# EAGLE design CANBedV1.1 (EAGLE 6.4)
DESCRIPTION: microOBD 200 OBD-II Module; HW_REV: 1.4; PCB_REV: C; PCB_SPEC1: Layer Count: 4; PCB_SPEC2: Size: 1.3" x 0.59"; PCB_SPEC3: Finish Thickness: 0.049" - 0.052"; PCB_SPEC4: Copper Weight: 1oz; TITLE: STM1120

## Sheet 1 of 2
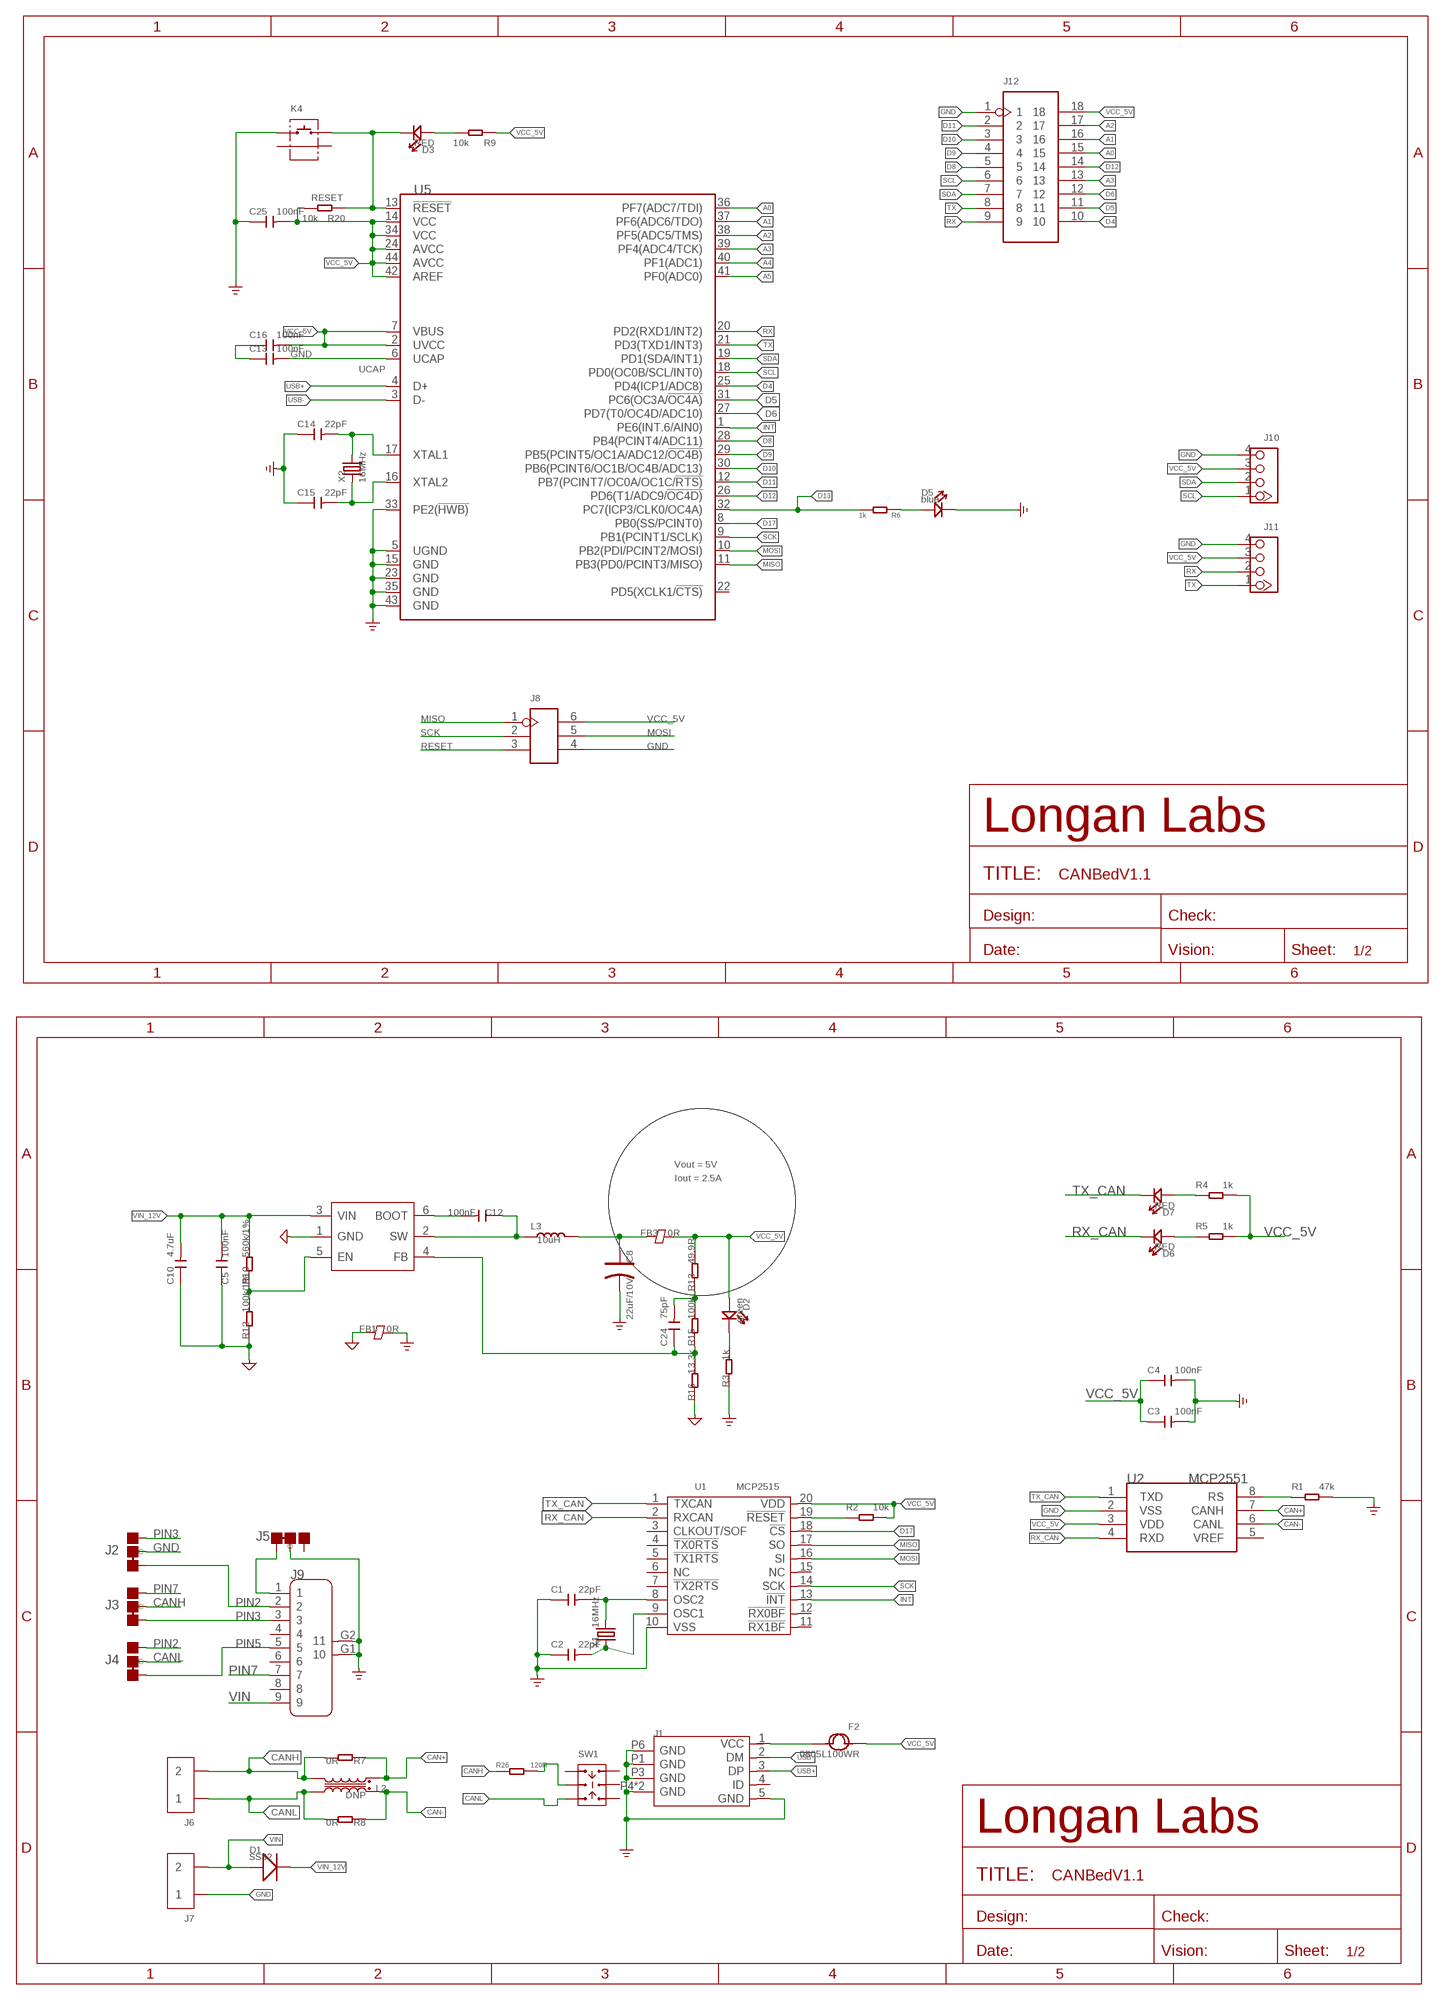
[diagram p0: schematic, sheet 1]

### Parts
C1  22pF  CAP-0603  [C0603]
C2  22pF  CAP-0603  [C0603]
C3  100nF  CAP-0603  [C0603]
C4  100nF  CAP-0603  [C0603]
C5  100nF  CAP-0603  [C0603]
C8  22uF/10V  CAP-POLAR-AVX-B  [AVX-B]
C10  4.7uF  CAP-1206  [C1206]
C12  100nF  CAP-0603  [C0603]
C13  100nF  CAP-0603  [C0603]
C14  22pF  CAP-0603  [C0603]
C15  22pF  CAP-0603  [C0603]
C16  100nF  CAP-0603  [C0603]
C24  75pF  CAP-0603  [C0603]
C25  100nF  CAP-0603  [C0603]
D1  SS32  DIODE'SMA'  [DO-214AC]
D2  green  LED'0603'  [LED-0603]
D3  RED  LED'0603'  [LED-0603]
D5  blue  LED'0603'  [LED-0603]
D6  RED  LED'0603'  [LED-0603]
D7  RED  LED'0603'  [LED-0603]
F2  0805L100WR  FUSE0805  [F0805]
FB1  0R  FERRITE-BEAD-0805  [F0805]
FB3  0R  FERRITE-BEAD-0805  [F0805]
J1  MICRO-USB5+4P-320010050  [MICRO-USB5+5P-SMD-0.65-7.2X5.06MM]
J2  JUMPER-3P-SHORT  [3P-SMD-SHORT]
J3  JUMPER-3P-SHORT  [3P-SMD-SHORT]
J4  JUMPER-3P-SHORT  [3P-SMD-SHORT]
J5  JUMPER-3P-SHORT  [3P-SMD-SHORT]
J6  SCREW-TERMINAL-2P'5.08'  [H2-5.0-10.5X8.0MM]
J7  SCREW-TERMINAL-2P'5.08'  [H2-5.0-10.5X8.0MM]
J8  HEADER-2X3P-2.54  [H2X3-2.54]
J9  DB9'MEAL'  [DB9-MEAL]
J10  320110033  GROVE-CONNECTOR-DIP-2.0  [HW4-2.0]
J11  320110033  GROVE-CONNECTOR-DIP-2.0  [HW4-2.0]
J12  HEADER-2X9P-2.54  [H2X9-2.54]
K4  BUTTON-2+2P  [SW2+2P-7.7X2.75X3.95MM]
L2  DNP  INDUCTOR-COMMON-MODE-SRF2012-900YA  [INT4-0.85-2X1.25X1.2MM]
L3  10uH  INDUCTOR-6.6X7.1  [INT2-SMD-6.6X7.1X3MM]
R1  47k  RES-0603  [R0603]
R2  10k  RES-0603  [R0603]
R3  1k  RES-0603  [R0603]
R4  1k  RES-0603  [R0603]
R5  1k  RES-0603  [R0603]
R6  1k  RES-0603  [R0603]
R7  0R  RES-0603  [R0603]
R8  0R  RES-0603  [R0603]
R9  10k  RES-0603  [R0603]
R10  560k/1%  RES-0603  [R0603]
R12  100k/1%  RES-0603  [R0603]
R13  49.9R  RES-0603  [R0603]
R15  100k  RES-0603  [R0603]
R16  13.3k  RES-0603  [R0603]
R20  10k  RES-0603  [R0603]
R26  120R  RES-0603  [R0603]
SW1  SWITCH-2CH-6P-311010004  [SW6-2.54-9.0X3.5X3.2+2.0MM]
U1  MCP2515  MCP2515'ST'  [TSSOP20-0.65-6.5X4.4MM]
U2  MCP2551  MCP2551-SOIC8  [SOIC8-6.0]
U5  MCU-ATMEGA32U4-AU  [TQFP44-0.8-9.6X9.6MM]
U6  PMIC-TPS54302  [SOT-23-6]
X1  16MHz  CRYSTAL-2P'HC49US'  [HC49US]
X2  16MHz  CRYSTAL-2P'HC49US'  [HC49US]

### Nets
A0: J12.15 U5.36(PF7(ADC7/TDI))
A1: J12.16 U5.37(PF6(ADC6/TDO))
A2: J12.17 U5.38(PF5(ADC5/TMS))
A3: J12.13 U5.39(PF4(ADC4/TCK))
A4: U5.40(PF1(ADC1))
A5: U5.41(PF0(ADC0))
AGND: C5.1 C10.1 FB1.1 R12.1 R16.1 U6.1(GND) ; supply symbol labelled GND_SIGNAL
CAN+: L2.4 R7.1 U2.7(CANH)
CAN-: L2.1 R8.1 U2.6(CANL)
CANH: J3.MM(C) J6.2 L2.3 R7.2 R26.1
CANL: J4.MM(C) J6.1 L2.2 R8.2 SW1.CH1B
D4: J12.10 U5.25(PD4(ICP1/ADC8))
D5: J12.11 U5.31(PC6(OC3A/!OC4A))
D6: J12.12 U5.27(PD7(T0/OC4D/ADC10))
D8: J12.5 U5.28(PB4(PCINT4/ADC11))
D9: J12.4 U5.29(PB5(PCINT5/OC1A/ADC12/!OC4B))
D10: J12.3 U5.30(PB6(PCINT6/OC1B/OC4B/ADC13))
D11: J12.2 U5.12(PB7(PCINT7/OC0A/OC1C/!RTS))
D12: J12.14 U5.26(PD6(T1/ADC9/!OC4D))
D13: R6.2 U5.32(PC7(ICP3/CLK0/OC4A))
D17: U1.18(!CS) U5.8(PB0(SS/PCINT0))
EXT_PWR: F2.2 J1.1(VCC)
GND: C1.1 C2.1 C3.2 C4.2 C8.- C13.1 C14.1 C15.1 C16.1 C25.1 D5.- FB1.2 J1.5(GND) J1.P1(GND) J1.P3(GND) J1.P4(GND) J1.P5(GND) J1.P6(GND) J2.MM(C) J5.MM(C) J7.1 J8.4 J9.G1 J9.G2 J10.4 J11.4 J12.1 K4.1 R1.2 R3.1 U1.10(VSS) U2.2(VSS) U5.5(UGND) U5.15(GND) U5.23(GND) U5.33(PE2(!HWB)) U5.35(GND) U5.43(GND) ; supply symbol labelled GND_POWER
INT: U1.13(!INT) U5.1(PE6(INT.6/AIN0))
MISO: J8.1 U1.17(SO) U5.11(PB3(PD0/PCINT3/MISO))
MOSI: J8.5 U1.16(SI) U5.10(PB2(PDI/PCINT2/MOSI))
N$1: D2.- R3.2
N$2: D7.+ R4.1
N$3: D3.+ R9.2
N$4: R10.1 R12.2 U6.5(EN)
N$5: R26.2 SW1.COM1
N$6: C14.2 U5.17(XTAL1) X2.2
N$8: D5.+ R6.1
N$11: C12.1 L3.1 U6.2(SW)
N$12: C15.2 U5.16(XTAL2) X2.1
N$13: J5.11(L) J9.1
N$14: C12.2 U6.6(BOOT)
N$15: D6.+ R5.1
N$16: C1.2 U1.8(OSC2) X1.2
N$17: C2.2 U1.9(OSC1) X1.1
N$19: C8.+ FB3.1 L3.2
N$20: R1.1 U2.8(RS)
N$23: C24.2 R13.1 R15.2
N$26: C24.1 R15.1 R16.2 U6.4(FB)
PIN2: J2.11(L) J4.00(R) J9.2
PIN3: J2.00(R) J3.11(L) J9.3
PIN5: J4.11(L) J9.5
PIN7: J3.00(R) J9.7
RESET: D3.- J8.3 K4.2 R20.1 U5.13(!RESET)
RST_N: R2.1 U1.19(!RESET)
RX: J11.2 J12.9 U5.20(PD2(RXD1/INT2))
RX_CAN: D6.- U1.2(RXCAN) U2.4(RXD)
SCK: J8.2 U1.14(SCK) U5.9(PB1(PCINT1/SCLK))
SCL: J10.1 J12.6 U5.18(PD0(OC0B/SCL/INT0))
SDA: J10.2 J12.7 U5.19(PD1(SDA/INT1))
TX: J11.1 J12.8 U5.21(PD3(TXD1/INT3))
TX_CAN: D7.- U1.1(TXCAN) U2.1(TXD)
UCAP: C13.2 U5.6(UCAP)
USB+: J1.3(DP) U5.4(D+)
USB-: J1.2(DM) U5.3(D-)
VCC_5V: C3.1 C4.1 C16.2 C25.2 D2.+ F2.1 FB3.2 J8.6 J10.3 J11.3 J12.18 R2.2 R4.2 R5.2 R9.1 R13.2 R20.2 U1.20(VDD) U2.3(VDD) U5.2(UVCC) U5.7(VBUS) U5.14(VCC) U5.24(AVCC) U5.34(VCC) U5.42(AREF) U5.44(AVCC)
VIN: D1.1(+) J7.2 J9.9
VIN_12V: C5.2 C10.2 D1.2(-) R10.2 U6.3(VIN)
Unconnected: J1.4(ID) J5.00(R) J9.4 J9.6 J9.8 K4.S1 K4.S2 SW1.CH1A SW1.CH2A SW1.CH2B SW1.COM2 U1.3(CLKOUT/SOF) U1.4(!TX0RTS) U1.5(!TX1RTS) U1.6(NC) U1.7(!TX2RTS) U1.11(!RX1BF) U1.12(!RX0BF) U1.15(NC) U2.5(VREF) U5.22(PD5(XCLK1/!CTS))

### Notes on the sheet
- Vout = 5V
- Iout = 2.5A

## Sheet 2 of 2

## Library data of the parts
C1-C5 C10 C12-C16 C24 C25 = Discrete-new:CAP: Ceramic Capacitors
C8 = Discrete-new:CAP-POLAR: Electrolytic Capacitors,Tantalum Capacitors and Super Capacitors
D1 = Discrete-new:DIODE*
D2 D3 D5-D7 = Discrete-new:LED
F2 = Discrete-small:FUSE
FB1 FB3 = Discrete-new:FERRITE-BEAD
J1 = Connector-new:MICRO-USB5+4P: 320010137:MICRO USB B型DIP 沉板0.7无卷边 -ST-USB-01H2 320010000:MICRO USB 5F CCHT 6.45(0.8X0.9) -ST-USB-001G 320010050:USB-MC-001-05 320010025:MICRO USB 5S AB TYPE DIP7.2
J2-J5 = Discrete-new:JUMPER-3P-SHORT
J6 J7 = Connector-new:SCREW-TERMINAL-2P: 2P-3.5:320110028;2P-5.0:320110031
J8 = Connector-new:HEADER-2X3P
J9 = Connector:DB9
J10 J11 = Connector-new:GROVE-CONNECTOR-DIP: 4P-2.0:320110033;4P-2.0-90D:320110034
J12 = Connector-new:HEADER-2X9P
K4 = Connector-new:BUTTON-2+2P
L2 = Discrete-new:INDUCTOR-COMMON-MODE
L3 = Discrete-new:INDUCTOR
R1-R10 R12 R13 R15 R16 R20 R26 = Discrete-new:RES
SW1 = Switch:SWITCH-2CH-6P
U1 = Heilight:MCP2515
U2 = IC:MCP2551: High-Speed CAN Transceiver http://ww1.microchip.com/downloads/en/devicedoc/21667f.pdf
U5 = IC-new:MCU-ATMEGA32U4: TQFP-44:310010010;VQFN-44:310010016
U6 = IC-new:PMIC-TPS54302
X1 X2 = Discrete-new:CRYSTAL-2P

## Net classes
0 default: width 0.152 mm, clearance 0.152 mm
3 usbvcc: width 0.152 mm, drill 0.152 mm, clearance 0.152 mm

## Board
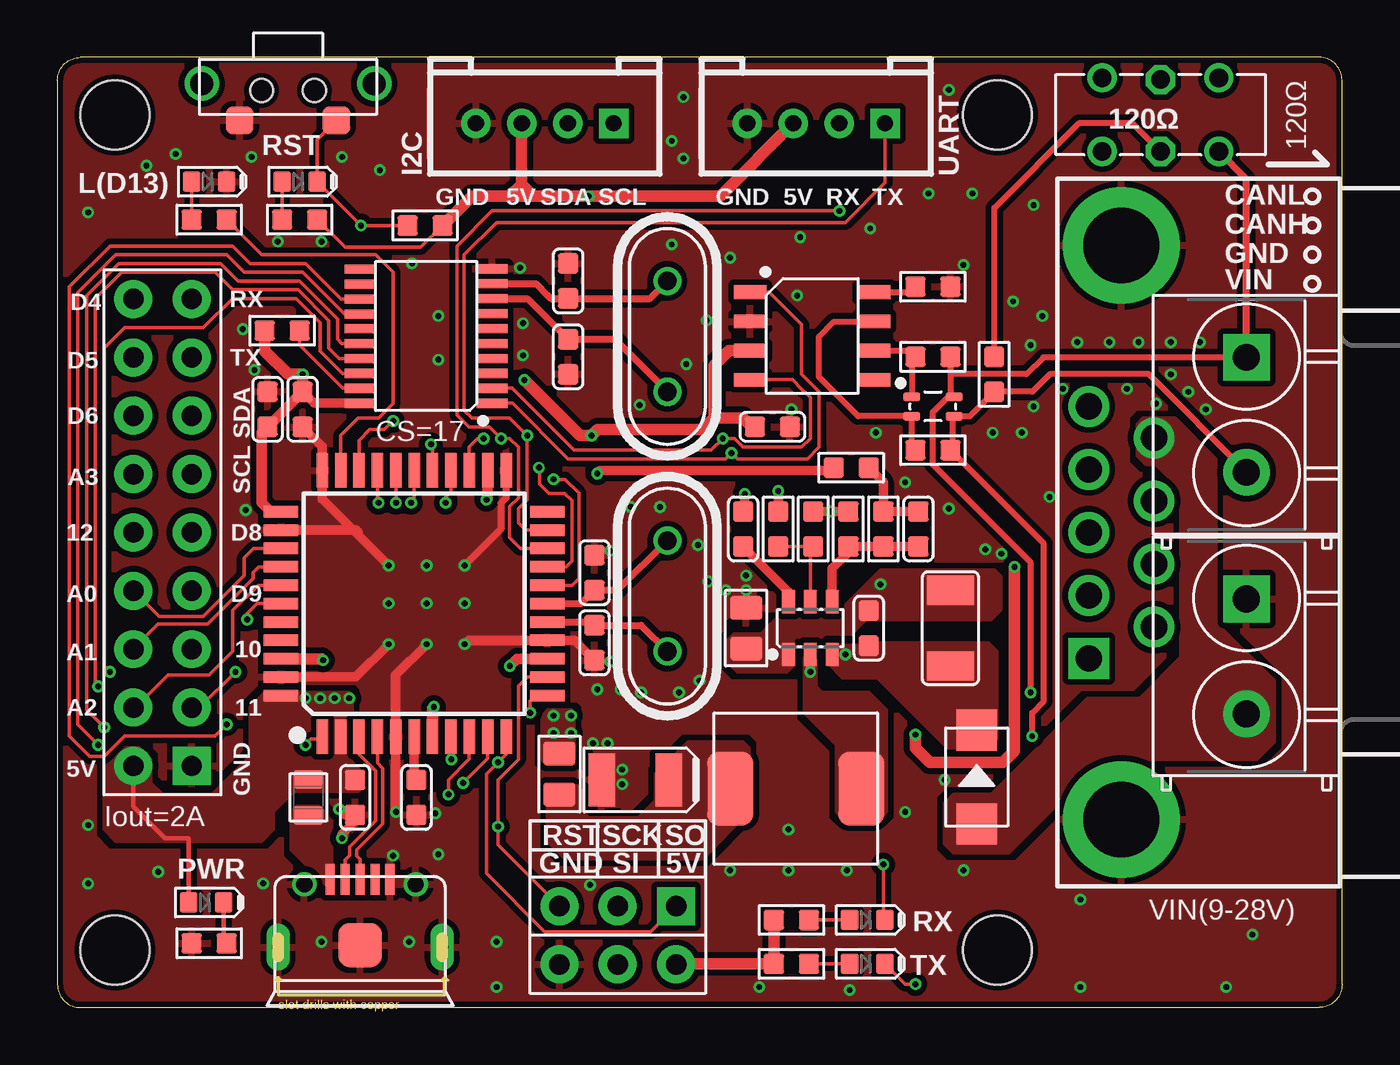
[diagram p1: board, top side]
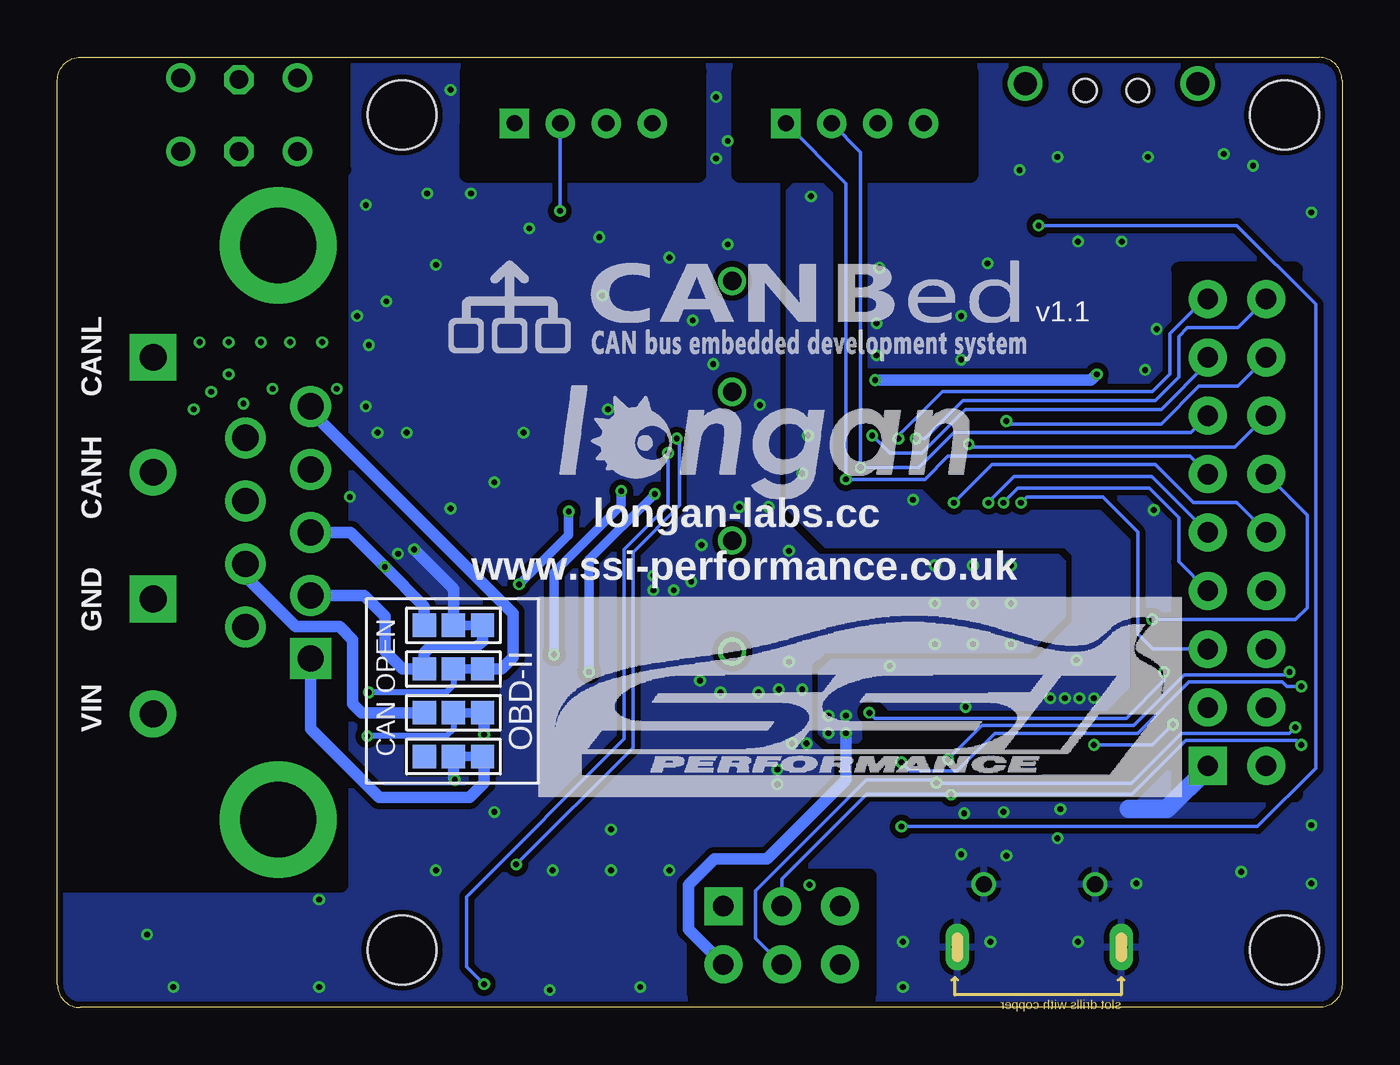
[diagram p2: board, bottom side, seen from below]

Size 55.91 x 41.35 mm. Coordinates in mm from the lower left corner, seen from the top.
Outline: 1,0 54.91,0 arc90 55.91,1 55.91,40.35 arc84 55.01,41.35 1,41.35 arc90 0,40.35 0,1 arc90 1,0
Copper layers (1*16): Top 0.035mm / dielectric 1.5mm / Bottom 0.035mm
Design rules "SeeedStudio_2layer_DRU_no_angle_20140221 *": minimum track width 1mil, minimum drill 10mil, track to track 6mil, track to pad 6mil, pad to pad 6mil, via to via 6mil, smd to smd 0mil, copper to edge 10mil, drill to drill 10mil, minimum pad ring 4mil, minimum via ring 4mil, stop-mask expansion 2mil, vias tented up to drill 25mil, thermal gap 10mil
Holes 3 mm at 2.5,38.85 2.5,2.5 40.91,38.85 40.91,2.5
bRestrict: area 16.2,36.3 to 26.2,40.7; area 28,36.2 to 38.1,40.7; area 2,9.3 to 7.1,32.1; area 43.6,5.3 to 55.8,36.1; area 20.6,0.6 to 28.2,5.7; area 43.4,36.5 to 52.6,41.3

### Footprints (pad centres in the part's own frame; a part is rotated, then mirrored left to right if it is on the bottom)
C0603 = smd 0.889 x 0.889: 1 -0.762,0; 2 0.762,0
AVX-B = smd 1.143 x 2.286: + 1.46,0; - -1.46,0
C1206 = smd 1.27 x 2.032: 1 -1.651,0; 2 1.651,0
DO-214AC = smd 1.8 x 1.77: 1 -2.042,0; 2 2.042,0
LED-0603 = smd 0.762 x 0.889: + 0.762,0; - -0.762,0
F0805 = smd 0.819 x 1.27: 1 -0.79,0; 2 0.79,0
F0805' = smd 1.016 x 1.397: 1 -0.889,0; 2 0.889,0
MICRO-USB5+5P-SMD-0.65-7.2X5.06MM = smd 0.4 x 1.35: 1 -1.3,2.875; 2 -0.65,2.875; 3 0,2.875; 4 0.65,2.875; 5 1.3,2.875 | smd 1.9 x 1.9: P1 0,0 | drill 0.508 pad 1.016 long: P3 -3.575,-0.08; P4 3.575,-0.08 | drill 0.7: P5 -2.425,2.65; P6 2.425,2.65
3P-SMD-SHORT = smd 1.016 x 1.016: 00 -1.27,0; 11 1.27,0; MM 0,0
H2-5.0-10.5X8.0MM = drill 1.168 pad 2.032 square: 1 0,2.5 | drill 1.168 pad 2.032: 2 0,-2.5
H2X3-2.54 = drill 0.889 pad 1.651 square: 1 -1.27,2.54 | drill 0.889 pad 1.651: 2 -1.27,0; 3 -1.27,-2.54; 4 1.27,-2.54; 5 1.27,0; 6 1.27,2.54
DB9-MEAL = drill 1.143 pad 1.778 square: 1 -5.486,1.422 | drill 1.143 pad 1.778: 2 -2.743,1.422; 3 0,1.422; 4 2.743,1.422; 5 5.486,1.422; 6 -4.115,-1.422; 7 -1.372,-1.422; 8 1.372,-1.422; 9 4.115,-1.422 | drill 3.302 pad 5.08: G1 12.497,0; G2 -12.497,0
HW4-2.0 = drill 0.7 pad 1.27 square: 1 -3,0 | drill 0.7 pad 1.27: 2 -1,0; 3 1,0; 4 3,0
H2X9-2.54 = drill 0.889 pad 1.651 square: 1 -1.27,10.16 | drill 0.889 pad 1.651: 2 -1.27,7.62; 3 -1.27,5.08; 4 -1.27,2.54; 5 -1.27,0; 6 -1.27,-2.54; 7 -1.27,-5.08; 8 -1.27,-7.62; 9 -1.27,-10.16; 10 1.27,-10.16; 11 1.27,-7.62; 12 1.27,-5.08; 13 1.27,-2.54; 14 1.27,0; 15 1.27,2.54; 16 1.27,5.08; 17 1.27,7.62; 18 1.27,10.16
SW2+2P-7.7X2.75X3.95MM = smd 1.2 x 1.2: 1 -2.1,0; 2 2.1,0 | drill 1 pad 1.5: S1 -3.75,1.6; S2 3.75,1.6 | hole 1: -1.15,1.3; 1.15,1.3
INT4-0.85-2X1.25X1.2MM = smd 0.4 x 0.75: 1 -0.425,-0.925; 2 -0.425,0.925; 3 0.425,0.925; 4 0.425,-0.925
INT2-SMD-6.6X7.1X3MM = smd 2 x 3.2: 1 -2.85,0; 2 2.85,0
R0603 = smd 0.889 x 0.889: 1 -0.762,0; 2 0.762,0
SW6-2.54-9.0X3.5X3.2+2.0MM = drill 0.813 pad 1.27: CH1A -2.54,-1.6; CH1B 2.54,-1.6; CH2A -2.54,1.6; CH2B 2.54,1.6 | drill 0.813 pad 1.27 octagon: COM1 0,-1.6; COM2 0,1.524
TSSOP20-0.65-6.5X4.4MM = smd 0.4 x 1.35: 1 -2.925,-2.875; 2 -2.275,-2.875; 3 -1.625,-2.875; 4 -0.975,-2.875; 5 -0.325,-2.875; 6 0.325,-2.875; 7 0.975,-2.875; 8 1.625,-2.875; 9 2.275,-2.875; 10 2.925,-2.875; 11 2.91,2.875; 12 2.26,2.875; 13 1.61,2.875; 14 0.96,2.875; 15 0.325,2.875; 16 -0.325,2.875; 17 -0.975,2.875; 18 -1.625,2.875; 19 -2.275,2.875; 20 -2.925,2.875
SOIC8-6.0 = smd 0.6 x 1.4: 1 -1.905,-2.7; 2 -0.635,-2.7; 3 0.635,-2.7; 4 1.905,-2.7; 5 1.905,2.7; 6 0.635,2.7; 7 -0.635,2.7; 8 -1.905,2.7
TQFP44-0.8-9.6X9.6MM = smd 1.5 x 0.5: 1 -5.8,4; 2 -5.8,3.2; 3 -5.8,2.4; 4 -5.8,1.6; 5 -5.8,0.8; 6 -5.8,0; 7 -5.8,-0.8; 8 -5.8,-1.6; 9 -5.8,-2.4; 10 -5.8,-3.2; 11 -5.8,-4; 23 5.8,-4; 24 5.8,-3.2; 25 5.8,-2.4; 26 5.8,-1.6; 27 5.8,-0.8; 28 5.8,0; 29 5.8,0.8; 30 5.8,1.6; 31 5.8,2.4; 32 5.8,3.2; 33 5.8,4 | smd 0.5 x 1.5: 12 -4,-5.8; 13 -3.2,-5.8; 14 -2.4,-5.8; 15 -1.6,-5.8; 16 -0.8,-5.8; 17 0,-5.8; 18 0.8,-5.8; 19 1.6,-5.8; 20 2.4,-5.8; 21 3.2,-5.8; 22 4,-5.8; 34 4,5.8; 35 3.2,5.8; 36 2.4,5.8; 37 1.6,5.8; 38 0.8,5.8; 39 0,5.8; 40 -0.8,5.8; 41 -1.6,5.8; 42 -2.4,5.8; 43 -3.2,5.8; 44 -4,5.8
SOT-23-6 = smd 0.55 x 1.016: 1 -0.95,-1.143; 2 0,-1.143; 3 0.95,-1.143; 4 0.95,1.143; 5 0,1.143; 6 -0.95,1.143
HC49US = drill 0.813: 1 -2.413,0; 2 2.413,0

### Placement (x,y rotation side)
C1  22.22,28.32 90 top
C2  22.22,31.62 270 top
C3  31.11,25.27 0 top
C4  10.67,26.04 270 top
C5  35.31,16.51 270 top
C8  25.15,9.91 0 top
C10  38.86,16.51 270 top
C12  29.84,20.83 270 top
C13  15.62,9.14 90 top
C14  23.37,18.92 270 top
C15  23.37,15.88 90 top
C16  12.95,9.14 90 top
C24  37.46,20.83 90 top
C25  9.14,26.04 270 top
D1  40,10.03 90 top
D2  6.48,4.57 180 top
D3  10.54,35.94 180 top
D5  6.6,35.94 180 top
D6  35.24,3.81 180 top
D7  35.24,1.91 180 top
F2  10.92,9.14 270 top
FB1  0R  [F0805']  29.97,16.51 90 top
FB3  0R  [F0805']  21.84,10.16 90 top
J1  13.17,2.71 0 top
J2  38.67,16.64 0 bottom
J3  38.67,12.83 0 bottom
J4  38.67,14.73 0 bottom
J5  38.67,10.92 0 bottom
J6  51.75,25.8 0 top
J7  51.75,15.28 0 top
J8  24.38,3.14 270 top
J9  46.31,20.68 90 top
J10  21.21,38.48 180 top
J11  33.02,38.48 180 top
J12  4.57,20.68 180 top
K4  10.03,38.61 0 top
L2  38.1,26.16 270 top
L3  32.13,9.52 180 top
R1  38.1,31.37 0 top
R2  9.78,29.46 180 top
R3  6.6,2.79 0 top
R4  31.94,1.91 180 top
R5  31.94,3.81 180 top
R6  6.6,34.29 0 top
R7  38.1,24.26 0 top
R8  38.1,28.32 0 top
R9  10.54,34.29 180 top
R10  31.37,20.83 90 top
R12  32.89,20.83 270 top
R13  34.54,23.5 180 top
R15  35.94,20.83 90 top
R16  34.42,20.83 270 top
R20  16,34.04 0 top
R26  40.77,27.56 90 top
SW1  48.01,38.86 0 top
U1  16.05,29.22 90 top
U2  32.85,29.23 270 top
U5  15.52,17.58 90 top
U6  32.77,16.51 0 top
U$12  [LONGAN-SILK-SMALL]  35.68,20.65 0 bottom
X1  26.54,29.21 270 top
X2  26.54,17.91 90 top

### Tracks (layer width: path | path; a pad name or v marks a point on that pad's centre or on a via)
A0
  Top 0.152: J12.15 4.42,17.02 6.35,17.02 8.13,18.8 8.13,19.56 8.55,19.98 U5.36
A1
  Top 0.152: J12.16 3.3,15.62 4.38,16.7 6.54,16.7 8.51,18.67 8.51,18.92 8.76,19.18 U5.37
A2
  Top 0.152: J12.17 3.4,13.05 4.83,14.48 6.6,14.48 7.62,15.49 7.62,17.27 8.73,18.38 U5.38
A3  (via drill 0.25 pad 0.51)
  Top 0.152: U5.39 8.69,17.58 8.25,17.14 v8.25,16.89
  Bottom 0.152: v8.25,16.89 2.03,16.89 1.52,17.4 1.52,21.44 J12.13
AGND  (via drill 0.25 pad 0.51)
  Top 0.406: R12.1 v33.66,21.59 R16.1
  Bottom 0.406: v35.81,18.41 33.66,20.57 v33.66,21.59
  pour Top (isolate 0.254, no thermals): 40.77,19.05 35.81,19.05 33.66,16.89 31.24,16.89 30.61,16.26 29.44,16.26 29.21,16.02 29.21,14.99 29.59,14.6 31.75,14.6 32,14.86 32,16 32.13,16.13 33.27,16.13 33.4,16.26 34.54,16.26 35.18,16.89 40.64,16.89 41.15,17.4 41.15,18.67
CAN+
  Top 0.254: R7.1 37.17,24.42 L2.4 34.84,25.74 33.15,27.43 33.15,29.21 33.78,29.84 35.53,29.84 U2.7
CAN-
  Top 0.254: 37.19,28.59 37.21,28.57 37.21,28.45 | L2.1 37.21,26.62 37.21,28.19 R8.1 37.21,28.45 | U2.6 35.69,28.59 | 35.69,28.59 37.07,28.59 37.21,28.45 | 35.69,28.57 35.69,28.59
CANH  (via drill 0.25 pad 0.51)
  Top 0.254: v42.42,11.81 42.42,12.83 42.93,13.34 42.93,20.19 R7.2 38.94,24.34 38.94,25.74 L2.3 39.71,25.74 R26.1 42.42,26.8 43.18,27.56 47.5,27.56 51.75,23.31 J6.2
  Bottom 0.254: J3.MM 38.67,12.13 38.99,11.81 v42.42,11.81
CANL  (via drill 0.25 pad 0.51)
  Top 0.254: v42.35,13.72 42.35,19.37 38.1,23.62 38.1,25.91 38.78,26.59 L2.2 38.86,26.75 38.86,27.56 | R8.2 38.86,27.56 | J6.1 42.9,28.3 42.16,27.56 38.86,27.56
  Top 0.305: J6.1 51.75,36.06 SW1.CH1B
  Bottom 0.254: J4.MM 38.67,14.03 38.99,13.72 v42.35,13.72
D4  (via drill 0.25 pad 0.51)
  Top 0.152: U5.25 17.92,24.4 18.29,24.77 v18.54,24.77
  Bottom 0.152: J12.10 4.55,29.59 6.73,29.59 7.11,29.21 7.11,27.43 8.13,26.42 16.51,26.42 18.16,24.77 v18.54,24.77
D5  (via drill 0.25 pad 0.51)
  Top 0.152: U5.31 13.12,24.68 13.59,25.15 14.22,25.15 v14.6,25.53
  Bottom 0.152: J12.11 4.55,27.05 6.22,27.05 7.87,25.4 14.48,25.4 v14.6,25.53
D6  (via drill 0.25 pad 0.51)
  Top 0.152: U5.27 16.32,24.44 v16.26,24.51
  Bottom 0.152: J12.12 4.67,24.38 16.13,24.38 v16.26,24.51
D8  (via drill 0.25 pad 0.51)
  Top 0.152: U5.28 15.52,22.13 15.49,22.1 15.49,22.07 v15.39,21.97
  Bottom 0.152: J12.5 8.28,23.11 14.27,23.11 15.21,22.17 15.21,22.15 v15.39,21.97
D9  (via drill 0.25 pad 0.51)
  Top 0.152: U5.29 v14.73,21.97
  Bottom 0.152: J12.4 7.11,19.41 7.11,21.34 8.38,22.61 14.1,22.61 v14.73,21.97
D10  (via drill 0.25 pad 0.51)
  Top 0.152: U5.30 13.92,22.02 v13.97,21.97
  Bottom 0.152: J12.3 8.23,15.59 8.89,16.26 8.89,20.7 10.41,22.23 13.72,22.23 v13.97,21.97
D11  (via drill 0.25 pad 0.51)
  Top 0.152: J12.2 6.2,13.05 v7.75,14.6 | 21.73,13.58 U5.12 20.82,13.58 20.57,13.34 v20.57,12.83
  Bottom 0.152: v7.75,14.6 7.75,14.22 9.4,12.57 20.32,12.57 v20.57,12.83
D12  (via drill 0.25 pad 0.51)
  Top 0.152: U5.26 17.12,22.46 16.89,22.23 v16.89,21.97
  Bottom 0.152: J12.14 3.3,20.7 4.57,21.97 6.48,21.97 8.13,23.62 14.48,23.62 15.24,23.62 v16.89,21.97
D13
  Top 0.152: R6.2 8.89,32.77 13.84,32.77 14.6,32 14.6,26.29 13.97,25.65 13.08,25.65 12.32,24.9 U5.32
D17  (via drill 0.25 pad 0.51)
  Top 0.152: U1.18 12.41,27.6 11.43,28.57 11.43,29.82 10.39,30.86 7.62,30.86 6.35,29.59 2.92,29.59 2.03,28.7 2.03,14.86 v2.29,14.6 | U5.8 17.14,11.76 v17.14,10.8
  Bottom 0.152: v2.29,14.6 2.41,14.48 6.86,14.48 9.07,12.27 15.67,12.27 v17.14,10.8
EXT_PWR
  pour Top (isolate 0.254, no thermals): 11.81,5.21 10.16,6.86 10.16,8.51 10.41,8.76 11.37,8.76 11.94,8.2 11.94,5.33
GND  (via drill 0.25 pad 0.51)
  Top 0.305: U5.23 19.52,22.18 19.3,21.95 19.3,20.83 v17.72,19.24
  Top 0.406: v12.26,8.64 12.51,8.38 C16.1 12.95,8.13 12.38,7.56 v12.38,7.37 | v14.41,19.24 11.52,22.13 U5.33 11.52,24.42 C4.2 | U5.35 13,20.78 13.08,20.7 | v17.72,15.81 17.88,15.98 U5.15 22.5,15.98 C15.1 | U5.43 12.98,14.38 v14.41,15.81 | v16.06,15.81 14.72,14.47 U5.5 v14.72,8.52 v14.73,8.51
  Bottom 0.508: J5.MM 38.67,9.97 v38.61,9.91 | J2.MM 38.67,18.22 v40.39,19.94
  Bottom 0.813: J12.1 5.84,10.41 7.62,8.64 9.27,8.64
  other vias: 29.97,18.16 29.08,18.16 28.32,18.54 29.97,18.8 25.4,13.72 27.05,13.72 27.94,14.22 23.49,13.84 24.51,13.84 14.6,6.6 16.07,17.59 17.72,17.59 14.41,17.59 16.07,19.24 8.19,21.65 8.57,27.75 8.06,29.53 9.59,33.34 11.49,33.34 20.13,32.19 20.26,29.78 20.26,28.38 28.26,29.91 26.73,33.21 39.43,32.32 38.8,39.94 26.23,21.78 24.96,21.78 12.38,37.02 8.45,37.02 5.14,37.15 3.87,36.64 1.33,34.61 1.33,7.94 1.33,5.4 4.38,5.91 8.95,5.4 11.49,2.86 15.3,2.86 19.11,2.86 16.57,6.67 19.11,0.89 30.54,0.89 34.48,0.76 44.51,0.89 44.51,4.7 39.43,5.97 36.89,8.51 34.35,5.97 31.81,5.97 29.27,5.97 31.81,7.75 23.18,5.33 50.86,0.89 52.01,3.17 42.48,34.92 39.81,35.43 35.37,33.91 32.32,33.53 32.19,30.99 35.62,25.02 29.27,32.64 27.24,36.96 26.73,37.72 14.03,36.45 15.43,32.38 16.57,28.19 16.57,30.1 42.86,30.1 41.59,30.73 40.7,25.02 41.97,25.02 49.72,28.96 41.08,19.75 43.18,22.23 37.91,35.43 27.24,39.62 48.45,27.56 47.05,28.96 45.78,28.96 44.39,28.96 42.35,28.83 42.48,26.16 43.75,26.92 46.55,26.92 47.82,26.29 49.97,26.04 48.45,28.96 49.21,26.8 31.94,26.04 16.45,8.45 23.3,11.49 24.57,10.35 24.57,9.72 23.94,11.49 27.88,20.13 24.07,15.05 24.07,19.88 27.37,28 25.34,26.23 38.8,21.72 36.89,22.86
  pour Top (isolate 0.254, no thermals): 29.21,17.02 29.72,17.02 30.35,17.65 30.35,18.67 29.97,19.05 28.32,19.05 27.3,18.03 27.3,14.73 26.92,14.35 23.62,14.35 22.99,13.72 22.99,12.57 23.37,12.19 28.07,12.19 28.57,12.7 28.57,16.38
  pour Top (isolate 0.254, rank 6): -0.64,41.91 56.51,41.91 56.51,-0.63 -0.64,-0.63
  pour Bottom (isolate 0.254, rank 6): -0.64,41.91 56.51,41.91 56.51,-0.63 -0.64,-0.63
  pour Top (isolate 0.254, no thermals): 23.62,11.68 24.64,11.68 24.89,11.43 24.89,9.02 24.64,8.76 23.88,8.76 23.37,9.27 23.37,11.56 23.49,11.68
INT  (via drill 0.25 pad 0.51)
  Top 0.152: U1.13 12.34,30.83 10.79,32.38 8.38,32.38 7.62,33.15 2.29,33.15 0.51,31.37 0.51,11.81 1.4,10.92 2.03,10.92 2.92,11.81 6.86,11.81 v7.37,12.32 | U5.1 11.43,11.68 11.05,11.68 v10.79,11.43
  Bottom 0.152: v10.79,11.43 8.25,11.43 v7.37,12.32
MISO  (via drill 0.25 pad 0.51)
  Top 0.152: U1.17 12.26,28.25 11.81,28.7 11.81,29.9 10.46,31.24 7.62,31.24 6.86,32 2.79,32 1.65,30.86 1.65,14.1 v1.78,13.97 | J8.1 25.81,3.3 21.21,3.3 18.67,5.84 18.67,10.16 v19.18,10.67 19.52,11.02 U5.11
  Bottom 0.152: v1.78,13.97 2.41,13.97 2.6,14.16 6.67,14.16 8.89,11.94 15.11,11.94 16.76,10.29 18.8,10.29 v19.18,10.67
MOSI  (via drill 0.25 pad 0.51)
  Top 0.152: v2.03,12.19 1.27,12.95 1.27,30.99 2.67,32.38 7.11,32.38 7.87,31.62 10.54,31.62 12.19,29.97 12.19,29.08 12.37,28.9 U1.16 | U5.10 18.72,10.85 v17.65,9.78
  Bottom 0.152: v2.03,12.19 2.29,11.94 6.98,11.94 9.17,9.75 17.63,9.75 v17.65,9.78 17.78,9.91 20.7,9.91 25.53,5.08 25.53,3.02 J8.5
N$1
  Top 0.203: D2.- 7.24,2.92 R3.2
N$2
  Top 0.152: D7.+ R4.1
N$3
  Top 0.152: D3.+ R9.2
N$4
  Top 0.152: U6.5 32.77,19.94 R12.2 R10.1
N$5
  Top 0.254: R26.2 40.77,34.8 44.45,38.48 46.79,38.48 SW1.COM1
N$6
  Top 0.305: U5.17 22.78,17.58 C14.2 24.38,18.16 X2.2
N$8
  Top 0.152: D5.+ R6.1
N$11  (via drill 0.25 pad 0.51)
  Top 0.406: U6.2 v32.77,14.6 | C12.1 29.91,21.65 v29.91,22.35
  Bottom 0.406: v29.91,22.35 32.77,19.49 v32.77,14.6
  pour Top (isolate 0.254, no thermals): 32.77,15.37 33.02,15.11 33.02,13.97 33.27,13.72 35.31,13.72 36.07,12.95 36.07,8.51 35.81,8.26 34.16,8.26 33.91,8.51 33.91,11.43 32.51,12.83 32.51,15.24 32.64,15.37
N$12
  Top 0.305: U5.16 23.23,16.78 C15.2 25.4,16.64 X2.1
N$13
  Bottom 0.508: J5.11 37.34,10.86 37.34,9.78 37.97,9.14 41.91,9.14 44.88,12.12 J9.1
N$14
  Top 0.406: U6.6 31.82,18.09 C12.2
N$15
  Top 0.152: D6.+ R5.1
N$16
  Top 0.305: U1.8 20.46,30.85 C1.2 24.26,29.08 X1.2
N$17
  Top 0.305: U1.9 20.82,31.5 21.34,30.99 21.46,30.86 C2.2 25.78,30.86 X1.1
N$19
  pour Top (isolate 0.254, no thermals): 29.84,11.56 27.43,11.56 26.03,10.16 26.03,9.02 25.27,8.26 23.11,8.26 22.86,8.51 22.86,9.4 22.61,9.65 21.59,9.65 21.34,9.4 21.34,7.24 22.1,6.48 28.07,6.48 30.1,8.51 30.1,11.3
N$20
  Top 0.254: U2.8 37.1,31.13 R1.1
N$23
  Top 0.406: C24.2 R15.2 35.94,22.86 R13.1
N$26
  Top 0.406: U6.4 33.72,19.11 34.42,19.81 R16.2 R15.1 C24.1
PIN2
  Bottom 0.508: J2.11 37.4,15.94 37.66,15.68 39.69,15.68 39.94,15.43 J4.00 40.89,14.73 41.66,15.49 41.66,17.02 42.57,17.93 J9.2
PIN3  (via drill 0.25 pad 0.51)
  Top 0.508: v41.66,19.18 41.66,11.18 41.15,10.67 37.97,10.67 37.34,11.3 v37.34,11.87
  Bottom 0.508: J2.00 39.94,17.46 v41.66,19.18 43.15,20.68 J9.3 | v37.34,11.87 37.34,12.76 J3.11
PIN5
  Bottom 0.508: J4.11 36.58,14.73 36.07,15.24 36.07,17.14 44.88,25.96 J9.5
PIN7
  Bottom 0.508: J9.7 47.73,18.77 45.53,16.57 43.62,16.57 43.05,16 43.05,13.21 42.67,12.83 J3.00
RESET  (via drill 0.25 pad 0.51)
  Top 0.152: R20.1 v13.21,34.04 D3.- 11.3,37.78 K4.2 | J8.3 19.18,7.08 v19.18,7.87 19.18,9.91 20.07,10.8 20.07,13.99 20.45,14.38 U5.13
  Bottom 0.152: v13.21,34.04 4.57,34.04 1.14,30.61 1.14,10.41 3.68,7.87 v19.18,7.87
RST_N
  Top 0.152: U1.19 12.42,26.95 10.54,28.83 R2.1
RX  (via drill 0.25 pad 0.51)
  Top 0.152: v34.04,34.67 18.92,34.67 17.4,33.15 17.4,25.78 17.91,25.27 18.8,25.27 v19.3,24.77 19.68,24.77 20.07,24.38 20.07,22.18 19.68,21.8 19.68,20.45 20.15,19.98 U5.20
  Bottom 0.152: J12.9 5.99,30.84 7.49,29.34 7.49,27.56 8.25,26.8 17.4,26.8 19.3,24.89 v19.3,24.77 | v34.04,34.67 34.04,38.47 J11.2
RX_CAN  (via drill 0.25 pad 0.51)
  Top 0.152: U1.2 19.79,26.95 22.48,24.26 28.45,24.26 v28.96,24.77 29.46,24.77 29.84,24.38 32.38,24.38 32.77,24.77 32.77,26.54 32.26,27.05 32.13,27.18 31.99,27.32 U2.4 29.73,27.32 | v35.94,6.22 35.94,3.87 D6.-
  Bottom 0.152: v35.94,6.22 30.86,11.3 30.86,19.81 28.83,21.84 28.83,24.64 v28.96,24.77
SCK  (via drill 0.25 pad 0.51)
  Top 0.152: U1.14 12.49,30.18 10.67,32 8.13,32 7.37,32.77 2.54,32.77 0.89,31.11 0.89,12.32 v1.78,11.43 | U5.9 17.92,10.81 17.02,9.91 v17.02,9.27
  Bottom 0.152: v1.78,11.43 1.97,11.62 6.79,11.62 9.14,9.27 v17.02,9.27 20.7,9.27 24.38,5.59 J8.2
SCL  (via drill 0.25 pad 0.51)
  Top 0.152: U5.18 22.4,18.38 22.69,18.67 22.69,22.39 22.1,22.99 v21.59,22.99
  Bottom 0.152: J12.6 6.63,24 17.14,24 18.16,22.99 v21.59,22.99 21.59,35.86 J10.1
SDA  (via drill 0.25 pad 0.51)
  Top 0.152: U5.19 22.14,19.18 22.39,19.43 22.39,22.06 22.07,22.38 21.39,22.38 20.98,22.79 20.98,23.47 v20.95,23.5
  Bottom 0.152: J12.7 6.58,25.02 16.89,25.02 18.41,23.5 v20.95,23.5 20.95,37.23 J10.2
TX  (via drill 0.25 pad 0.51)
  Top 0.152: J11.1 36.02,35.89 34.29,34.16 19.1,34.16 17.7,32.77 17.7,25.98 18.03,25.65 19.68,25.65 v20.45,24.89 20.45,22.1 20.07,21.72 20.07,21.08 20.37,20.78 U5.21
  Bottom 0.152: J12.8 5.84,28.07 7.87,26.04 16.38,26.04 18.29,24.13 19.68,24.13 v20.45,24.89
TX_CAN  (via drill 0.25 pad 0.51)
  Top 0.152: U1.1 19.8,26.3 22.22,23.88 29.08,23.88 v29.34,24.13 29.59,23.88 32.64,23.88 33.15,24.38 33.15,26.8 32.38,27.56 32.38,29.72 30.97,31.13 U2.1 30.21,31.13 | v37.34,1.02 36.89,1.02 D7.-
  Bottom 0.152: v29.34,24.13 29.34,21.84 31.24,19.94 31.24,11.68 38.1,4.83 38.1,1.78 v37.34,1.02
UCAP
  Top 0.406: U5.6 15.52,10 C13.2
USB+
  Top 0.152: J1.3 13.17,6.45 13.02,6.6 13.02,6.86 14.15,7.99 14.15,10.41 13.92,10.64 U5.4
USB-
  Top 0.152: J1.2 12.52,6.42 12.71,6.62 12.71,6.98 13.84,8.12 13.84,10.29 13.12,11.01 U5.3
VCC_5V  (via drill 0.25 pad 0.51)
  Top 0.152: R9.1 12.51,33.08 15.81,33.08 R20.2
  Top 0.203: D2.+ 5.71,7.37 4.7,7.37 3.3,8.76 3.3,10.41 | 3.3,10.41 3.17,10.54 3.17,10.67 3.3,10.54 3.3,10.41
  Top 0.406: v23.49,23.24 23.62,23.37 33.66,23.37 R13.2 | C4.1 11.16,26.3 U1.20
  Top 0.457: U5.34 9.28,21.58 8.89,21.97 8.89,25.02 C25.2 C4.1 | U5.24 18.72,22.15 v18.67,22.1 | U5.14 20,15.18 v19.68,14.86
  Top 0.508: J10.3 20.21,35.32 20.19,35.31 | 20.7,35.31 v23.11,35.31 28.84,35.31 J11.3 | 20.7,35.31 20.19,35.31 | 20.19,35.31 19.68,35.31 | 19.68,35.31 18.03,35.31 R20.2 | 19.68,35.31 20.19,35.81 20.7,35.31 | v20.32,27.3 22.73,24.89 v23.24,24.89 23.49,25.15 28.07,25.15 28.57,25.65 | R5.2 R4.2 26.96,1.91 J8.6 | C4.1 v10.67,27.56 10.03,27.56 9.02,28.57 R2.2 | U2.3 29.23,28.59 28.57,27.94 28.57,25.65 | C3.1 30.23,25.27 29.84,25.65 28.57,25.65 | U5.42 11.49,15.18 v11.56,15.11 | U5.7 16.32,13.02 v16.38,13.08
  Bottom 0.508: v10.67,27.56 10.92,27.3 v20.32,27.3 | J8.6 28.45,3.4 28.45,5.33 27.3,6.48 25.02,6.48 21.59,9.91 v21.59,11.94
  other vias: 12.7,13.46 12.06,13.46 11.43,13.46 10.79,13.46 22.35,11.94 22.35,12.7 21.59,12.7
  pour Top (isolate 0.254, no thermals): 9.4,7.75 8.89,7.24 2.54,7.24 2.03,7.75 2.03,10.41 2.92,11.3 3.56,11.3 4.06,10.8 4.06,9.78 4.57,9.27 6.73,9.27 8.38,10.92 8.38,13.08 9.02,13.72 12.7,13.72 12.83,13.59 12.83,12.95 12.45,12.57 12.45,11.05 13.33,10.16 13.33,9.65 13.08,9.4 10.29,9.4 9.4,8.51
  pour Bottom (isolate 0.254, no thermals): 13.33,15.11 22.22,15.11 22.73,14.6 22.73,11.94 22.35,11.56 21.08,11.56 20.95,11.68 20.95,13.08 20.7,13.34 20.07,13.34 19.43,12.7 10.54,12.7 9.27,13.97 9.27,20.32 10.54,21.59 17.4,21.59 18.29,22.48 21.84,22.48 22.22,22.86 22.22,35.43 22.61,35.81 23.88,35.81 24.13,35.56 24.13,21.72 22.48,20.07 12.06,20.07 11.68,19.68 11.68,16.76
  pour Top (isolate 0.254, no thermals): 22.48,12.32 22.48,12.83 22.35,12.95 21.34,12.95 21.08,12.7 21.08,10.8 21.21,10.67 22.35,10.67 22.48,10.8
VIN
  pour Top (isolate 0.254, no thermals): 47.24,25.65 48.64,25.65 50.42,23.88 50.42,16.76 52.96,14.22 52.96,11.56 52.2,10.8 45.47,10.8 41.4,6.73 38.99,6.73 38.61,7.11 38.61,8.89 38.99,9.27 40.64,9.27 44.83,13.46 47.1,13.46 48.89,15.26 48.89,22.53 47.8,23.62 47.37,23.62 46.99,24 46.99,25.4
VIN_12V  (via drill 0.25 pad 0.51)
  Top 0.406: 31.37,21.97 R10.2 v31.37,22.48
  Bottom 0.406: v31.37,22.48 31.37,21.84 34.29,18.92 v34.29,15.37
  pour Top (isolate 0.254, no thermals): 38.73,11.3 40.51,11.3 40.89,11.68 40.89,15.49 40.51,15.88 35.18,15.88 35.05,15.75 33.89,15.75 33.53,15.39 33.53,14.99 34.16,14.35 35.69,14.35

### Text on the board
tPlace: 120Ω | RST | 120Ω | I2C | UART | L(D13) | GND | 5V | SDA | SCL | GND | 5V | RX | TX | CANL | CANH | GND | VIN | D4 | RX | D5 | TX | D6 | SDA | CS=17 | A3 | SCL | 12 | D8 | D9 | A0 | 10 | A1 | 11 | A2 | GND | 5V | Iout=2A | RST | SCK | SO | PWR | GND | SI | 5V | RX | VIN(9-28V) | TX
bPlace: v1.1 | CANL | CANH | longan-labs.cc | GND | www.ssi-performance.co.uk | VIN | OBD-II | CAN OPEN